# Altium schematic sheet [1]ROV_Filter.SchDoc
size A3
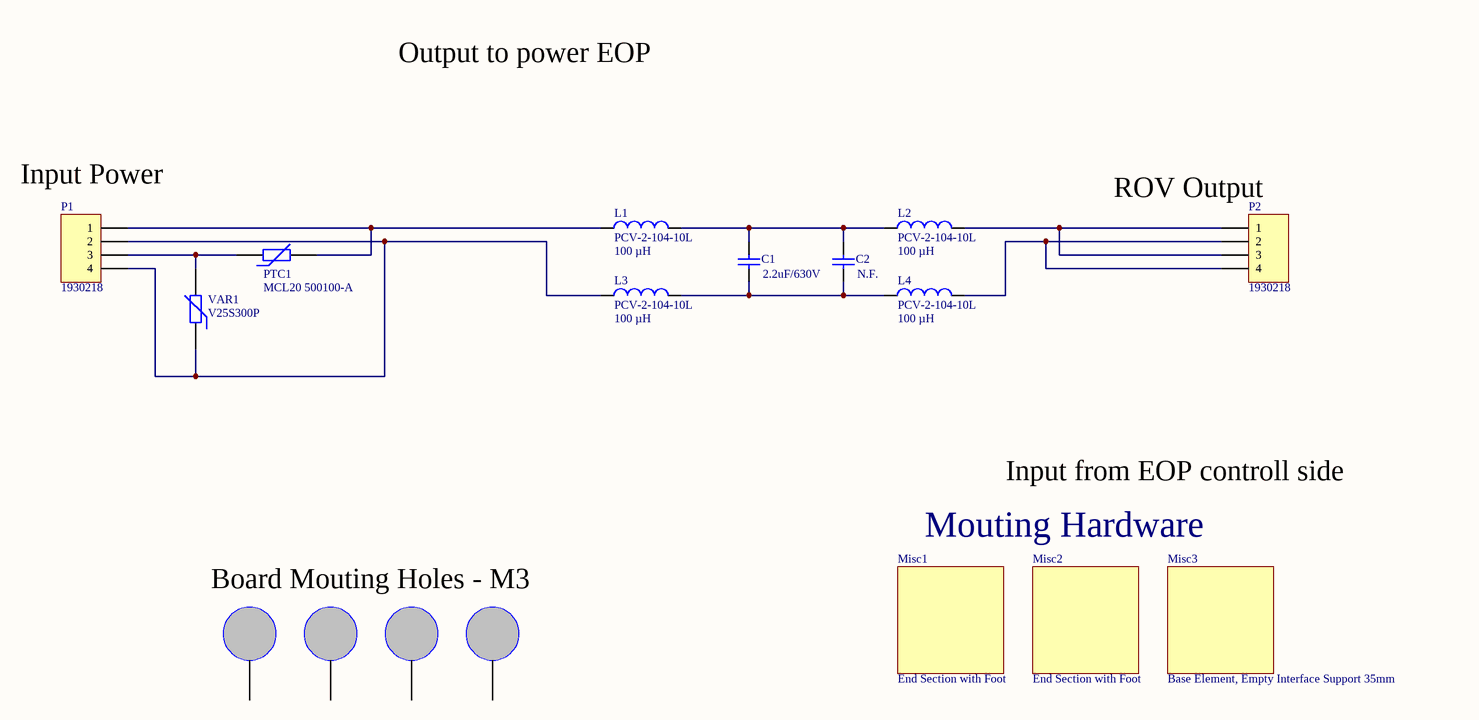
[diagram p0: [1]ROV_Filter.SchDoc]

## Parts
C1  value 2.2uF/630V  [ECWFD Cap Straight Type]  (hidden comment: 0603)
C2  value N.F.  [ECWFD Cap Straight Type]  (hidden comment: 0603)
L1  PCV-2-104-10L  value 100 µH  [PCV-2]
L2  PCV-2-104-10L  value 100 µH  [PCV-2]
L3  PCV-2-104-10L  value 100 µH  [PCV-2]
L4  PCV-2-104-10L  value 100 µH  [PCV-2]
MH1  Mouting Hole  [M3 Mounting Hole]  (value not drawn)  (no BOM)
MH2  Mouting Hole  [M3 Mounting Hole]  (value not drawn)  (no BOM)
MH3  Mouting Hole  [M3 Mounting Hole]  (value not drawn)  (no BOM)
MH4  Mouting Hole  [M3 Mounting Hole]  (value not drawn)  (no BOM)
Misc1  End Section with Foot  (mechanical)
Misc2  End Section with Foot  (mechanical)
Misc3  Base Element, Empty Interface Support 35mm  (mechanical)
P1  1930218  [Phoenix Contact 1930218]
P2  1930218  [Phoenix Contact 1930218 REVERSED]
PTC1  MCL20 500100-A  [MCL20 PTC]
VAR1  V25S300P  [UltraMOV 25S Varistor Series]

## Nets
NetC1_1: C1.1 C2.1 L3.2 L4.1
NetC1_2: C1.2 C2.2 L1.2 L2.1
NetL1_1: L1.1 P1.1 PTC1.2
NetL2_2: L2.2 P2.1 P2.3
NetL3_1: L3.1 P1.2 P1.4 VAR1.1
NetL4_2: L4.2 P2.2 P2.4
NetP1_3: P1.3 PTC1.1 VAR1.2

Not connected (* = marked no-connect by the designer): MH1 1; MH2 1; MH3 1; MH4 1

## Notes on the sheet
- Output to power EOP
- (near P1) Input Power
- (near P2) ROV Output
- Mouting Hardware
- Input from EOP controll side
- Board Mouting Holes - M3

## Library data of the parts
C1 C2 = Cap: Capacitor; Note: We have them in Bulgaria; Published: 8-Jun-2000; LatestRevisionDate: 17-Jul-2002; LatestRevisionNote: Re-released for DXP Platform.; PackageReference: RAD-0.3; Publisher: Altium Limited; PackageDescription: Radial Cap, Thru-Hole; 2 Leads; 0.3 in Pin Spacing; Case Code (in): ECWFD Cap Straight Type
L1-L4 = Inductor: Code_IEC: 1005; Note: We have them in Bulgaria; Published: 8-Jun-2000; LatestRevisionDate: 29-May-2009; LatestRevisionNote: IPC-7351 Footprint Added.; PackageReference: 0402-A; Publisher: Altium Limited; PackageDescription: Chip Inductor; Code_JEITA: 0402
Misc1 Misc2 = Empty Component: Manufacturer Part No.: CIME/E/SEF1000S; Manufacturer Name: CAMDENBOSS; Distributor Link: https://uk.farnell.com/camdenboss/cime-e-sef1000s/module-din-107mm-side-foot-11/dp/1774459
Misc3 = Empty Component: Manufacturer Part No.: CIME/E/BE3500S; Manufacturer Name: CAMDENBOSS; Distributor Link: https://uk.farnell.com/camdenboss/cime-e-be3500s/module-din-107mm-base-35mm/dp/1774456?ost=CIME%2FE%2FBE3500S&ddkey=https%3Aen-GB%2FElement14_United_Kingdom%2Fsearch
P1 P2 = Header 4: Header, 4-Pin; Manufacturer Name: Phoenix Contact; LatestRevisionDate: 17-Jul-2002; LatestRevisionNote: Re-released for DXP Platform.; Publisher: Altium Limited; Distributor Link: https://eu.mouser.com/ProductDetail/Phoenix-Contact/1930218?qs=ur4COD7pGFv5LOzi9Ltyeg==; Manufacturer Part No.: 1930218
PTC1 = Res Varistor: Varistor (Voltage-Sensitive Resistor); Manufacturer Name: Ametherm; Published: 24-Mar-1999; LatestRevisionDate: 29-May-2009; LatestRevisionNote: IPC-7351 Footprint Added.; PackageVersion: Mar-2003; PackageReference: 6-0805; Publisher: Altium Limited; PackageDescription: Chip Resistor 0805 Case Size; Code_IPC: RESC2012; Distributor Link: https://www.digikey.com/product-detail/en/ametherm/MCL20-500100-A/570-1437-ND/7896579; Manufacturer Part No.: MCL20 500100-A
VAR1 = Res Varistor: Varistor (Voltage-Sensitive Resistor); Manufacturer Name: Littelfuse Inc.; Published: 24-Mar-1999; LatestRevisionDate: 29-May-2009; LatestRevisionNote: IPC-7351 Footprint Added.; PackageVersion: Mar-2003; PackageReference: 6-0805; Publisher: Altium Limited; PackageDescription: Chip Resistor 0805 Case Size; Code_IPC: RESC2012; Distributor Link: https://www.digikey.com/products/en/circuit-protection/tvs-varistors-movs/141?k=&pkeyword=&sv=0&pv604=185&sf=0&FV=mu468.5V%7C2148%2Cmu470V%7C2148%2Cmu471.5V%7C2148%2Cffe0008d&quantity=&ColumnSort=-604&page=1&stock=1&nstock=1&pageSize=25; Manufacturer Part No.: V25S300P